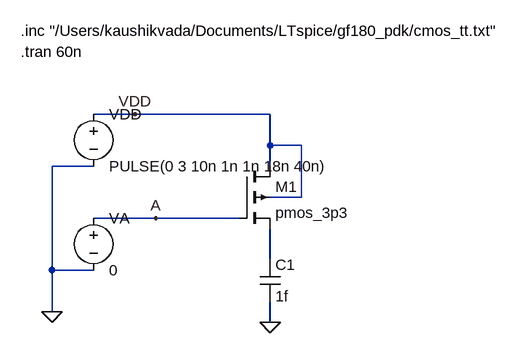
[diagram p0: schematic Q2_6.asc]
Q2_6.asc, the LTspice schematic file:
Version 4
SHEET 1 900 600
WIRE 224 96 160 96
WIRE 432 96 224 96
WIRE 432 144 432 96
WIRE 480 144 432 144
WIRE 160 176 96 176
WIRE 432 176 432 144
WIRE 480 224 480 144
WIRE 480 224 432 224
WIRE 256 256 160 256
WIRE 384 256 256 256
WIRE 432 320 432 272
WIRE 96 336 96 176
WIRE 160 336 96 336
WIRE 96 400 96 336
WIRE 432 416 432 384
FLAG 224 96 VDD
FLAG 256 256 A
FLAG 96 400 0
FLAG 432 416 0
SYMBOL voltage 160 80 R0
SYMATTR InstName VDD
SYMATTR Value PULSE(0 3 10n 1n 1n 18n 40n)
SYMBOL voltage 160 240 R0
SYMATTR InstName VA
SYMATTR Value 0
SYMBOL pmos4 384 176 R0
SYMATTR InstName M1
SYMATTR Value pmos_3p3
SYMATTR SpiceLine W=4u L=1u
SYMBOL cap 416 320 R0
SYMATTR InstName C1
SYMATTR Value 1f
TEXT 48 -32 Left 2 !.inc "/Users/kaushikvada/Documents/LTspice/gf180_pdk/cmos_tt.txt"
TEXT 48 0 Left 2 !.tran 60n

The netlist it stands for:
* Q2_6.asc
VDD VDD 0 PULSE(0 3 10n 1n 1n 18n 40n)
VA A 0 0
M1 VDD A N001 VDD pmos_3p3 W=4u L=1u
C1 N001 0 1f
.model NMOS NMOS
.model PMOS PMOS
.lib standard.mos
.inc "/Users/kaushikvada/Documents/LTspice/gf180_pdk/cmos_tt.txt"
.tran 60n
.backanno
.end